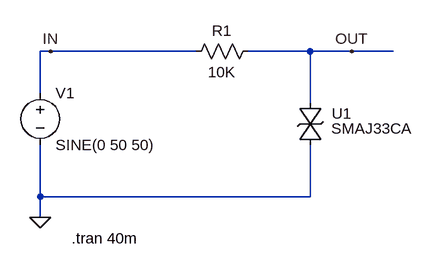
[diagram p0: schematic SMAJ33CA.asc]
SMAJ33CA.asc, the LTspice schematic file:
Version 4.1
SHEET 1 880 680
WIRE 16 112 0 112
WIRE 240 112 16 112
WIRE 416 112 320 112
WIRE 480 112 416 112
WIRE 544 112 480 112
WIRE 0 176 0 112
WIRE 416 192 416 112
WIRE 0 336 0 256
WIRE 416 336 416 256
WIRE 416 336 0 336
WIRE 0 368 0 336
FLAG 0 368 0
FLAG 16 112 IN
FLAG 480 112 OUT
SYMBOL voltage 0 160 R0
WINDOW 123 0 0 Left 0
WINDOW 39 0 0 Left 0
SYMATTR InstName V1
SYMATTR Value SINE(0 50 50)
SYMBOL res 336 96 R90
WINDOW 0 0 56 VBottom 2
WINDOW 3 32 56 VTop 2
SYMATTR InstName R1
SYMATTR Value 10K
SYMBOL MyLib\\Diode_TVS\\SMAJ33CA 400 192 R0
SYMATTR InstName U1
TEXT 48 400 Left 2 !.tran 40m

The netlist it stands for:
* SMAJ33CA.asc
V1 IN 0 SINE(0 50 50)
R1 OUT IN 10K
X§U1 OUT 0 SMAJ33CA  ; pins + -
.tran 40m
.lib MyLib/Diode_TVS/_TVS_Zetex.lib
.backanno
.end